# Altium schematic sheet Digital_STMG447RET6.SchDoc
size A3; SheetNumber: 3; SheetTotal: 4
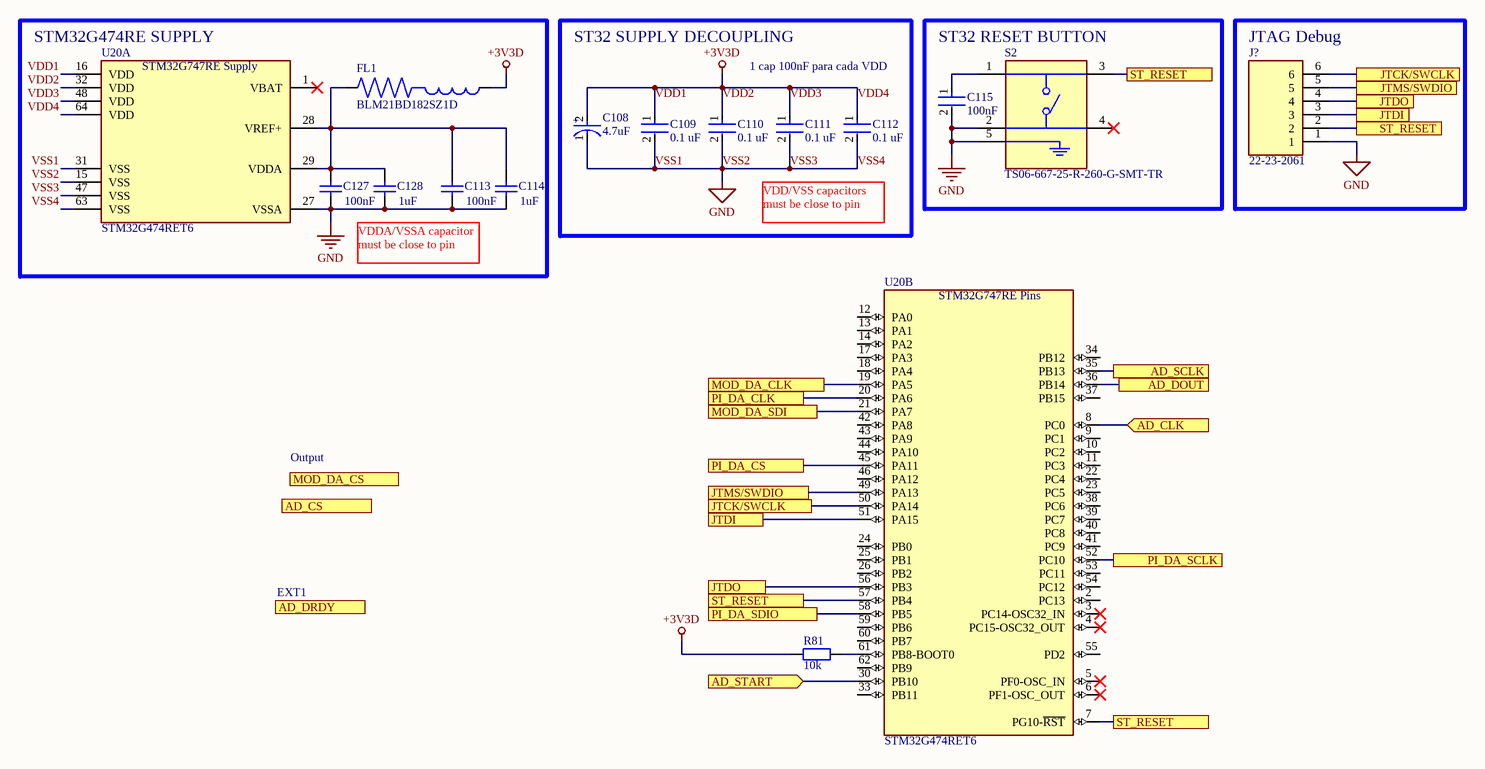
[diagram p0: Digital_STMG447RET6.SchDoc]

## Parts
C108  4.7uF  [FP-TAJR-MFG]
C109  0.1 uF  [FP-CC0805-0_85-MFG]
C110  0.1 uF  [FP-CC0805-0_85-MFG]
C111  0.1 uF  [FP-CC0805-0_85-MFG]
C112  0.1 uF  [FP-CC0805-0_85-MFG]
C113  value 100nF  [RAD-0.3]  (hidden comment: Cap)
C114  value 1uF  [RAD-0.3]  (hidden comment: Cap)
C115  100nF  [FP-CC0805-0_85-MFG]
C127  value 100nF  [RAD-0.3]  (hidden comment: Cap)
C128  value 1uF  [RAD-0.3]  (hidden comment: Cap)
FL1  BLM21BD182SZ1D  [BLM21BD182SZ1D]
J?  22-23-2061  [22-23-2061]
R81  value 10k  [AXIAL-0.4]  (hidden comment: Res2)
S2  TS06-667-25-R-260-G-SMT-TR  [TS06-667-25-R-260-G-SMT-TR]
U20  STM32G474RET6  [STMG474RET6]  (parts A,B of 2)

## Blocks framed on the sheet
STM32G474RE SUPPLY: C113 C114 C127 C128 FL1 U20
ST32 SUPPLY DECOUPLING: C108-C112
ST32 RESET BUTTON: C115 S2
JTAG Debug: J?

## Ports
AD_CLK (in, see Analog_Acquisition_Circuit[5C], Digital_Supply_and_Connectors[2A], Digital_Supply_and_Connectors[4A]), AD_CS (in, see Analog_Acquisition_Circuit[3C], Digital_Supply_and_Connectors[1A], Digital_Supply_and_Connectors[4A]), AD_DOUT (see Analog_Acquisition_Circuit[4C], Digital_Supply_and_Connectors[1A]), AD_DRDY (out, see Analog_Acquisition_Circuit[4C], Digital_Supply_and_Connectors[1A]), AD_SCLK (see Analog_Acquisition_Circuit[5C], Digital_Supply_and_Connectors[1A], Digital_Supply_and_Connectors[4A]), AD_START (in, see Analog_Acquisition_Circuit[3C], Digital_Supply_and_Connectors[1A], Digital_Supply_and_Connectors[4A]), JTCK/SWCLK (see Digital_STMG447RET6[3B]), JTCK/SWCLK (see Digital_STMG447RET6[6A]), JTDI (see Digital_STMG447RET6[3B]), JTDI (see Digital_STMG447RET6[6A]), JTDO (see Digital_STMG447RET6[3B]), JTDO (see Digital_STMG447RET6[6A]), JTMS/SWDIO (see Digital_STMG447RET6[3B]), JTMS/SWDIO (see Digital_STMG447RET6[6A]), MOD_DA_CLK (see Analog_Modulation_and_Supply[5A], Digital_Supply_and_Connectors[1B]), MOD_DA_CS (see Analog_Modulation_and_Supply[5A], Digital_Supply_and_Connectors[1B], Digital_Supply_and_Connectors[3B]), MOD_DA_SDI (see Analog_Modulation_and_Supply[5A], Digital_Supply_and_Connectors[1B]), PI_DA_CLK (see Analog_Modulation_and_Supply[1A], Digital_Supply_and_Connectors[1B], Digital_Supply_and_Connectors[3B]), PI_DA_CS (see Analog_Modulation_and_Supply[1A], Digital_Supply_and_Connectors[1B], Digital_Supply_and_Connectors[3B]), PI_DA_SCLK (see Analog_Modulation_and_Supply[1A], Digital_Supply_and_Connectors[2B], Digital_Supply_and_Connectors[4B]), PI_DA_SDIO (see Analog_Modulation_and_Supply[1A], Digital_Supply_and_Connectors[2B], Digital_Supply_and_Connectors[4B]), ST_RESET (see Digital_STMG447RET6[3B], Digital_STMG447RET6[5A], Digital_STMG447RET6[5B]), ST_RESET (see Digital_STMG447RET6[3B], Digital_STMG447RET6[5A], Digital_STMG447RET6[6A]), ST_RESET (see Digital_STMG447RET6[3B], Digital_STMG447RET6[5B], Digital_STMG447RET6[6A]), ST_RESET (see Digital_STMG447RET6[5A], Digital_STMG447RET6[5B], Digital_STMG447RET6[6A])

## Nets
VDD1: C108.2(A) C109.1 C110.1 C111.1 C112.1 FL1.1 R81.1 U20.16(VDD) U20.32(VDD) U20.48(VDD) U20.64(VDD)  [also labelled +3V3D, VDD2, VDD3, VDD4]
VSS1: C108.1(C) C109.2 C110.2 C111.2 C112.2 C113.1 C114.1 C115.2 C127.1 C128.1 J?.1 S2.2 S2.5 U20.15(VSS) U20.27(VSSA) U20.31(VSS) U20.47(VSS) U20.63(VSS)  [also labelled GND, VSS2, VSS3, VSS4]
AD_CLK: U20.8(PC0) ; port AD_CLK
AD_DOUT: U20.36(PB14) ; port AD_DOUT
AD_SCLK: U20.35(PB13) ; port AD_SCLK
AD_START: U20.30(PB10) ; port AD_START
JTCK/SWCLK: J?.6 U20.50(PA14) ; port JTCK/SWCLK
JTDI: J?.3 U20.51(PA15) ; port JTDI
JTDO: J?.4 U20.56(PB3) ; port JTDO
JTMS/SWDIO: J?.5 U20.49(PA13) ; port JTMS/SWDIO
MOD_DA_CLK: U20.19(PA5) ; port MOD_DA_CLK
MOD_DA_SDI: U20.21(PA7) ; port MOD_DA_SDI
PI_DA_CLK: U20.20(PA6) ; port PI_DA_CLK
PI_DA_CS: U20.45(PA11) ; port PI_DA_CS
PI_DA_SCLK: U20.52(PC10) ; port PI_DA_SCLK
PI_DA_SDIO: U20.58(PB5) ; port PI_DA_SDIO
ST_RESET: J?.2 S2.3 U20.7(PG10-~{RST}) U20.57(PB4) ; port ST_RESET
NetC113_2: C113.2 C114.2 C127.2 C128.2 FL1.2 U20.28(VREF+) U20.29(VDDA)
NetC115_1: C115.1 S2.1
NetR81_2: R81.2 U20.61(PB8-BOOT0)

Not connected (* = marked no-connect by the designer): S2 4*; U20 1(VBAT)* 2(PC13) 3(PC14-OSC32_IN)* 4(PC15-OSC32_OUT)* 5(PF0-OSC_IN)* 6(PF1-OSC_OUT)* 9(PC1) 10(PC2) 11(PC3) 12(PA0) 13(PA1) 14(PA2) 17(PA3) 18(PA4) 22(PC4) 23(PC5) 24(PB0) 25(PB1) 26(PB2) 33(PB11) 34(PB12) 37(PB15) 38(PC6) 39(PC7) 40(PC8) 41(PC9) 42(PA8) 43(PA9) 44(PA10) 46(PA12) 53(PC11) 54(PC12) 55(PD2) 59(PB6) 60(PB7) 62(PB9)

## Notes on the sheet
- 1 cap 100nF para cada VDD
- VDD/VSS capacitors must be close to pin
- VDDA/VSSA capacitor must be close to pin
- Output
- EXT1
- (in symbol CMP-2007-04030-2) +
- (in symbol STM32G474RET6, part A) STM32G747RE Supply
- (in symbol STM32G474RET6, part B) STM32G747RE Pins

## Library data of the parts
C108 = CMP-2007-04030-2: 4.7uF 10V  ±10% 9Ω 0805  SMD Tantalum Capacitor; Dissipation Factor: 6%; ESR (Equivalent Series Resistance): 9R; Leakage Current: 500nA; Polarity: Polar; Lead Free: Lead Free; Min Operating Temperature: -55°C; Width: 1.3mm; Depth: 1.3mm; Case Code (Metric): 2012; Features: General Purpose; Length: 2.05mm; Package Quantity: 1; Tolerance: 10%; Height - Seated (Max): 0.047inch; REACH SVHC: No SVHC; Termination: SMD/SMT; Max Operating Temperature: 125°C; Mount: Surface Mount; Case/Package: 0805; Packaging: Tape and Reel; Case Code (Imperial): 0805; Voltage: 10V; Dielectric Material: Tantalum; Weight: 0.000194oz; Construction: Flat; Series: TAJ; Radiation Hardening: No; Voltage Rating: 10V; Height: 1.2mm; Capacitance: 4.7uF; RoHS Compliant: Yes
C109-C112 = CMP-1036-04410-2: CAP CER 0.1UF 25V X7R 0805; Manufacturer Part Number: CC0805KRX7R8BB104; Manufacturer: Yageo; Tolerance: 0.1; Material: Ceramic; Value: 100 nF; ComponentLink2URL: http://www.yageo.com/documents/recent/UPY-GPHC_Y5V_6.3V-to-50V_8.pdf; Category: Cap; Mouser Description: Multilayer Ceramic Capacitors MLCC - SMD/SMT 100nF 25V X7R 10%; Device Class L1: Passive Components; Footprint Url: http://www.yageo.com/exep/pages/download/literatures/UPY-C_GEN_24.pdf; Height: 0.95mm; Digikey Description: CAP CER 0.1UF 25V X7R 0805; Lead Free: Yes; Temperature Range High: +85°C; Temperature: -30°C to +85°C; Ipc Land Pattern Name: CAPC200125X85; Capacitance: 100 nF; Automotive: No; Octopart: https://octopart.com/cc0805krx7r8bb104-yageo-39467766; Device Class L2: Capacitors; Temperature Characteristic: X7R; Voltage Rating: 25 V; ComponentLink2Description: Datasheet; Temperature Range Low: -30°C; Device Class L3: Ceramic Capacitors; RoHS: TRUE; Package: CC0805-0.85
C113 C114 C127 C128 = Cap: Capacitor; Published: 8-Jun-2000; LatestRevisionDate: 17-Jul-2002; LatestRevisionNote: Re-released for DXP Platform.; PackageReference: RAD-0.3; Publisher: Altium Limited; PackageDescription: Radial Cap, Thru-Hole; 2 Leads; 0.3 in Pin Spacing
C115 = CMP-1036-04410-2: CAP CER 0.1UF 25V X7R 0805; Manufacturer Part Number: CC0805KRX7R8BB104; Manufacturer: Yageo; Tolerance: 0.1; Material: Ceramic; ComponentLink2URL: http://www.yageo.com/documents/recent/UPY-GPHC_Y5V_6.3V-to-50V_8.pdf; Category: Cap; Mouser Description: Multilayer Ceramic Capacitors MLCC - SMD/SMT 100nF 25V X7R 10%; Device Class L1: Passive Components; Footprint Url: http://www.yageo.com/exep/pages/download/literatures/UPY-C_GEN_24.pdf; Height: 0.95mm; Digikey Description: CAP CER 0.1UF 25V X7R 0805; Lead Free: Yes; Temperature Range High: +85°C; Temperature: -30°C to +85°C; Ipc Land Pattern Name: CAPC200125X85; Value: 100 nF; Capacitance: 100 nF; Automotive: No; Octopart: https://octopart.com/cc0805krx7r8bb104-yageo-39467766; Device Class L2: Capacitors; Temperature Characteristic: X7R; Voltage Rating: 25 V; ComponentLink2Description: Datasheet; Temperature Range Low: -30°C; Device Class L3: Ceramic Capacitors; RoHS: TRUE; Package: CC0805-0.85
J? = 22-23-2061: 2.54mm,header,KK,vert,Sn,frictn lock,6w Molex KK 254 Series, Series Number 6373, 2.54mm Pitch 6 Way 1 Row Straight PCB Header, Through Hole, Solder Termination; Geometry.Height: 11.05mm; Manufacturer_Name: Molex; Manufacturer_Part_Number: 22-23-2061; Mouser Part Number: 538-22-23-2061; Mouser Price/Stock: https://www.mouser.co.uk/ProductDetail/Molex/22-23-2061?qs=ILqg114nvd6YkpLBwrcQsQ%3D%3D; Arrow Part Number: *; Arrow Price/Stock: *; Datasheet Link: http://www.molex.com/pdm_docs/sd/022232061_sd.pdf
R81 = Res2: Resistor; Published: 8-Jun-2000; LatestRevisionDate: 17-Jul-2002; LatestRevisionNote: Re-released for DXP Platform.; PackageReference: AXIAL-0.4; Publisher: Altium Limited; PackageDescription: Axial Device, Thru-Hole; 2 Leads; 0.4 in Pin Spacing
S2 = TS06-667-25-R-260-G-SMT-TR: 6 x 6.7 mm, 2.5 mm Actuator Height, 260 gf, Red, Surface Mount, SPST, Tactile Switch; MF: Same Sky; SnapEDA_Link: https://www.snapeda.com/parts/TS06-667-25-R-260-G-SMT-TR/Same+Sky/view-part/?ref=snap; Package: None; Value: *; MP: TS06-667-25-R-260-G-SMT-TR; Check_prices: https://www.snapeda.com/parts/TS06-667-25-R-260-G-SMT-TR/Same+Sky/view-part/?ref=eda
U20 = STM32G474RET6: ARMÂ® CortexÂ®-M4F STM32G4 Microcontroller IC 32-Bit Single-Core 170MHz 512KB (512K x 8) FLASH 64-LQFP (10x10); MF: STMicroelectronics; SnapEDA_Link: https://www.snapeda.com/parts/STM32G474RET6/STMicroelectronics/view-part/?ref=snap; Package: LQFP-64 STMicroelectronics; Value: *; MP: STM32G474RET6; Check_prices: https://www.snapeda.com/parts/STM32G474RET6/STMicroelectronics/view-part/?ref=eda
FL1 = BLM21BD182SZ1D: Package: None; Price: None; Value: *; MP: BLM21BD182SZ1D; Availability: Unavailable